# EAGLE design slave (EAGLE 6.5.0)
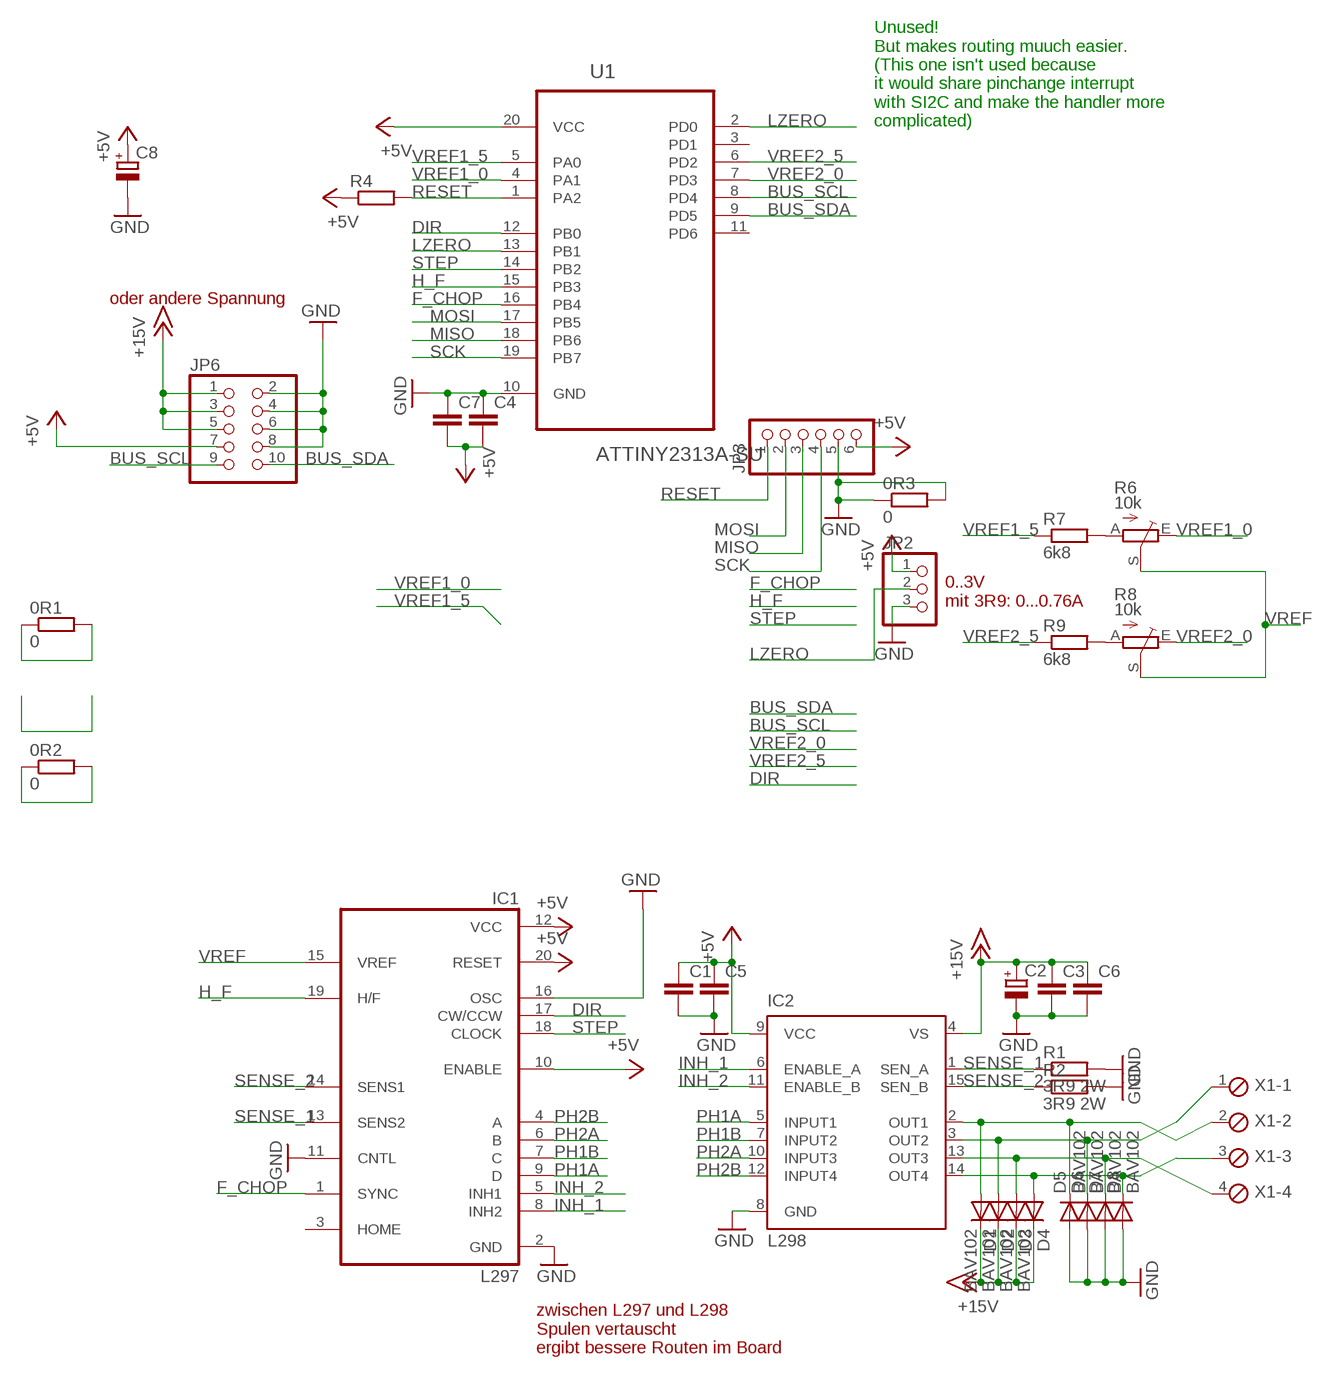
[diagram p0: schematic, sheet 1]

## Parts
0R1  0  R-EU_R1206  [R1206]
0R2  0  R-EU_R1206  [R1206]
0R3  0  R-EU_R1206  [R1206]
C1  C-EUC0805  [C0805]
C2  CPOL-EUE2.5-7  [E2,5-7]
C3  C-EUC0805  [C0805]
C4  C-EUC0805  [C0805]
C5  C-EUC0805  [C0805]
C6  C-EUC0805  [C0805]
C7  C-EUC0805  [C0805]
C8  CPOL-EUE2.5-7  [E2,5-7]
D1  BAV102  DIODE-MINIMELF  [MINIMELF]
D2  BAV102  DIODE-MINIMELF  [MINIMELF]
D3  BAV102  DIODE-MINIMELF  [MINIMELF]
D4  BAV102  DIODE-MINIMELF  [MINIMELF]
D5  BAV102  DIODE-MINIMELF  [MINIMELF]
D6  BAV102  DIODE-MINIMELF  [MINIMELF]
D7  BAV102  DIODE-MINIMELF  [MINIMELF]
D8  BAV102  DIODE-MINIMELF  [MINIMELF]
IC1  L297  [DIL20]
IC2  L298  [MULTIWATT-15]
JP2  PINHD-1X3  [1X03]
JP3  PINHD-1X6  [1X06]
JP6  PINHD-2X5  [2X05]
R1  3R9 2W  R-EU_0414/15  [0414/15]
R2  3R9 2W  R-EU_0414/15  [0414/15]
R4  R-EU_R1206  [R1206]
R6  10k  TRIM_EU-PT10  [PT-10]
R7  6k8  R-EU_R1206  [R1206]
R8  10k  TRIM_EU-PT10  [PT-10]
R9  6k8  R-EU_R1206  [R1206]
U1  ATTINY2313A-SU  [SOIC127P1032X265-20N]
X1  MPT4  [4POL254]

## Nets
+5V: 0R1.1 0R1.2 C1.1 C4.2 C5.1 C7.2 C8.+ IC1.10(ENABLE) IC1.12(VCC) IC1.20(RESET) IC2.9(VCC) JP2.1 JP3.6 JP6.7 R4.1 U1.20(VCC)
+15V: C2.+ C3.1 C6.1 D1.C D2.C D3.C D4.C IC2.4(VS) JP6.1 JP6.3 JP6.5
BUS_SCL: JP6.9 U1.8(PD4)
BUS_SDA: JP6.10 U1.9(PD5)
DIR: IC1.17(CW/CCW) U1.12(PB0)
F_CHOP: IC1.1(SYNC) U1.16(PB4)
GND: 0R3.1 0R3.2 C1.2 C2.- C3.2 C4.1 C5.2 C6.2 C7.1 C8.- D5.A D6.A D7.A D8.A IC1.2(GND) IC1.11(CNTL) IC1.16(OSC) IC2.8(GND) JP2.3 JP3.5 JP6.2 JP6.4 JP6.6 JP6.8 R1.2 R2.2 U1.10(GND)
H_F: IC1.19(H/F) U1.15(PB3)
INH_1: IC1.8(INH2) IC2.6(ENABLE_A)
INH_2: IC1.5(INH1) IC2.11(ENABLE_B)
LZERO: JP2.2 U1.2(PD0) U1.13(PB1)
MISO: JP3.3 U1.18(PB6)
MOSI: JP3.2 U1.17(PB5)
N$1: R6.A R7.2
N$3: R8.A R9.2
N$12: D1.A D5.C IC2.2(OUT1) X1.2
N$13: D2.A D6.C IC2.3(OUT2) X1.1
N$14: D3.A D7.C IC2.13(OUT3) X1.4
N$15: D4.A D8.C IC2.14(OUT4) X1.3
PH1A: IC1.9(D) IC2.5(INPUT1)
PH1B: IC1.7(C) IC2.7(INPUT2)
PH2A: IC1.6(B) IC2.10(INPUT3)
PH2B: IC1.4(A) IC2.12(INPUT4)
RESET: JP3.1 R4.2 U1.1(PA2)
SCK: JP3.4 U1.19(PB7)
SENSE_1: IC1.13(SENS2) IC2.1(SEN_A) R1.1
SENSE_2: IC1.14(SENS1) IC2.15(SEN_B) R2.1
STEP: IC1.18(CLOCK) U1.14(PB2)
VREF: 0R2.1 0R2.2 IC1.15(VREF) R6.S R8.S
VREF1_0: R6.E U1.4(PA1)
VREF1_5: R7.1 U1.5(PA0)
VREF2_0: R8.E U1.7(PD3)
VREF2_5: R9.1 U1.6(PD2)
Unconnected: IC1.3(HOME) U1.3(PD1) U1.11(PD6)

## Notes on the sheet
- Unused!
  But makes routing muuch easier.
  (This one isn't used because
  it would share pinchange interrupt
  with SI2C and make the handler more
  complicated)
- oder andere Spannung
- 0..3V
  mit 3R9: 0...0.76A
- zwischen L297 und L298
  Spulen vertauscht
  ergibt bessere Routen im Board

## Library data of the parts
0R1-0R3 R1 R2 R4 R7 R9 = rcl:R-EU_: RESISTOR, European symbol
C1 C3-C7 = rcl:C-EU: CAPACITOR, European symbol
C2 C8 = rcl:CPOL-EU: POLARIZED CAPACITOR, European symbol
D1-D8 = diode:DIODE-: DIODE
IC1 = st-microelectronics:L297: STEPPER MOTOR CONTROLLER; MPN: L297/1; OC_FARNELL: 1094209; OC_NEWARK: 56P8258
IC2 = l298pad:L298: DUAL FULL-BRIDGE DRIVER; MPN: L298N; OC_FARNELL: 1589425; OC_NEWARK: 32M1527
JP2 = pinhead:PINHD-1X3: PIN HEADER
JP3 = pinhead:PINHD-1X6: PIN HEADER
JP6 = pinhead:PINHD-2X5: PIN HEADER
R6 R8 = pot:TRIM_EU-: POTENTIOMETER
U1 = Atmel_By_element14_Batch_1-00:ATTINY2313A-SU: 8-bit Microcontroller with In-System Programmable Flash; MPN: ATTINY2313A-SU; OC_FARNELL: 1841617; OC_NEWARK: 12T1334; PACKAGE: SOIC-20; SUPPLIER: Atmel
X1 = con-phoenix-254:MPT4: PHOENIX CONNECTOR; OC_FARNELL: unknown; OC_NEWARK: unknown

## Board
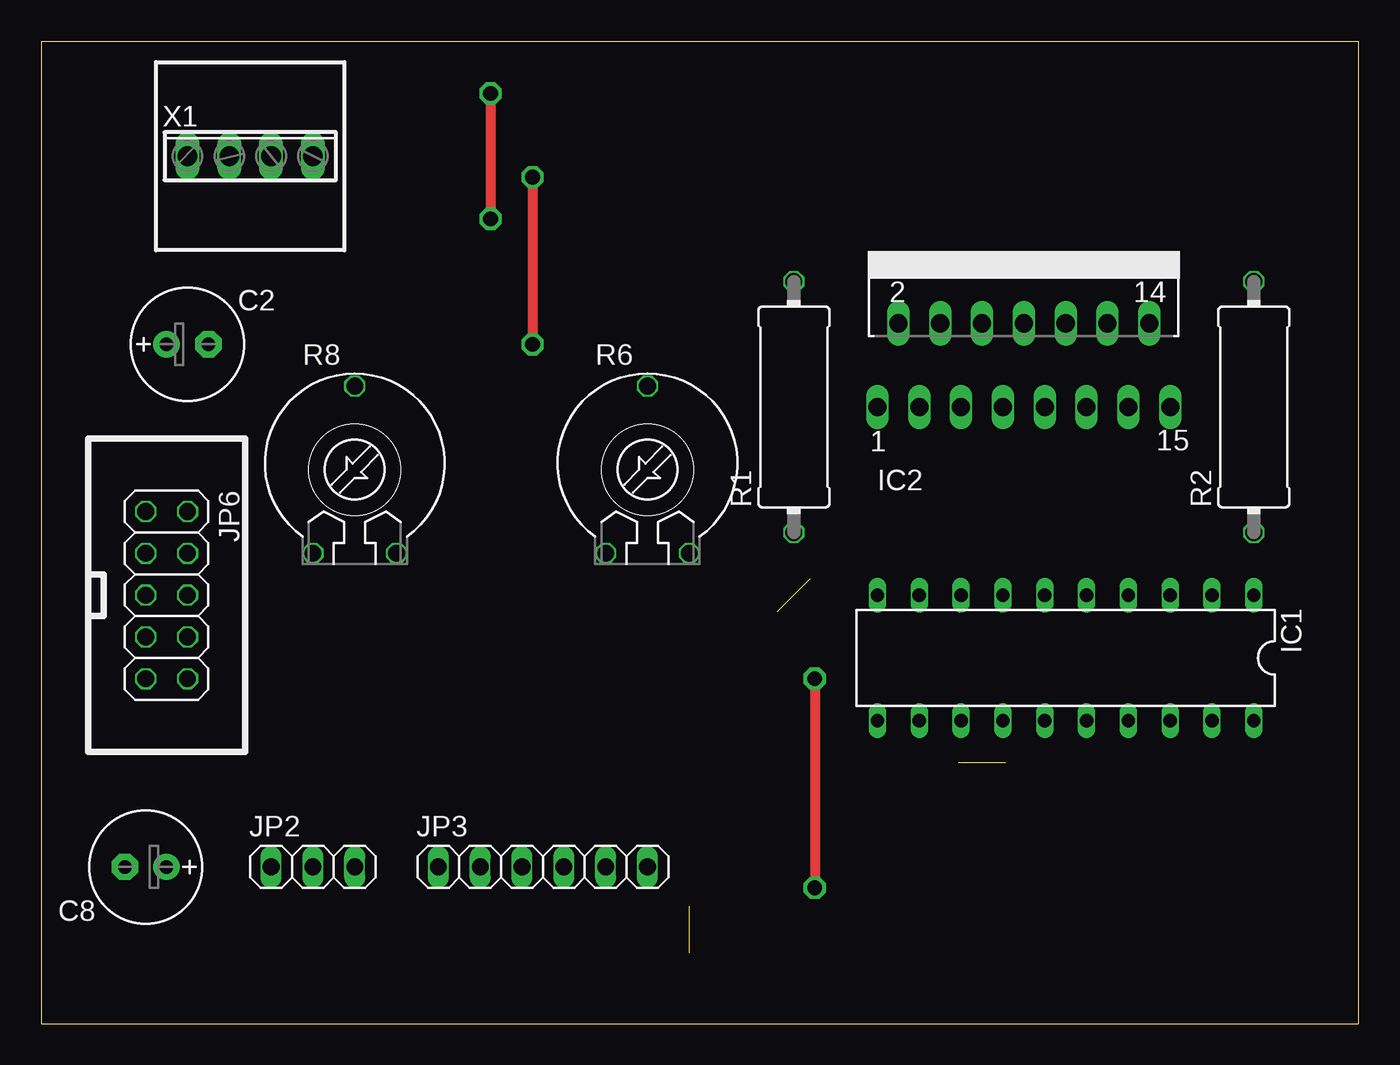
[diagram p1: board, top side]
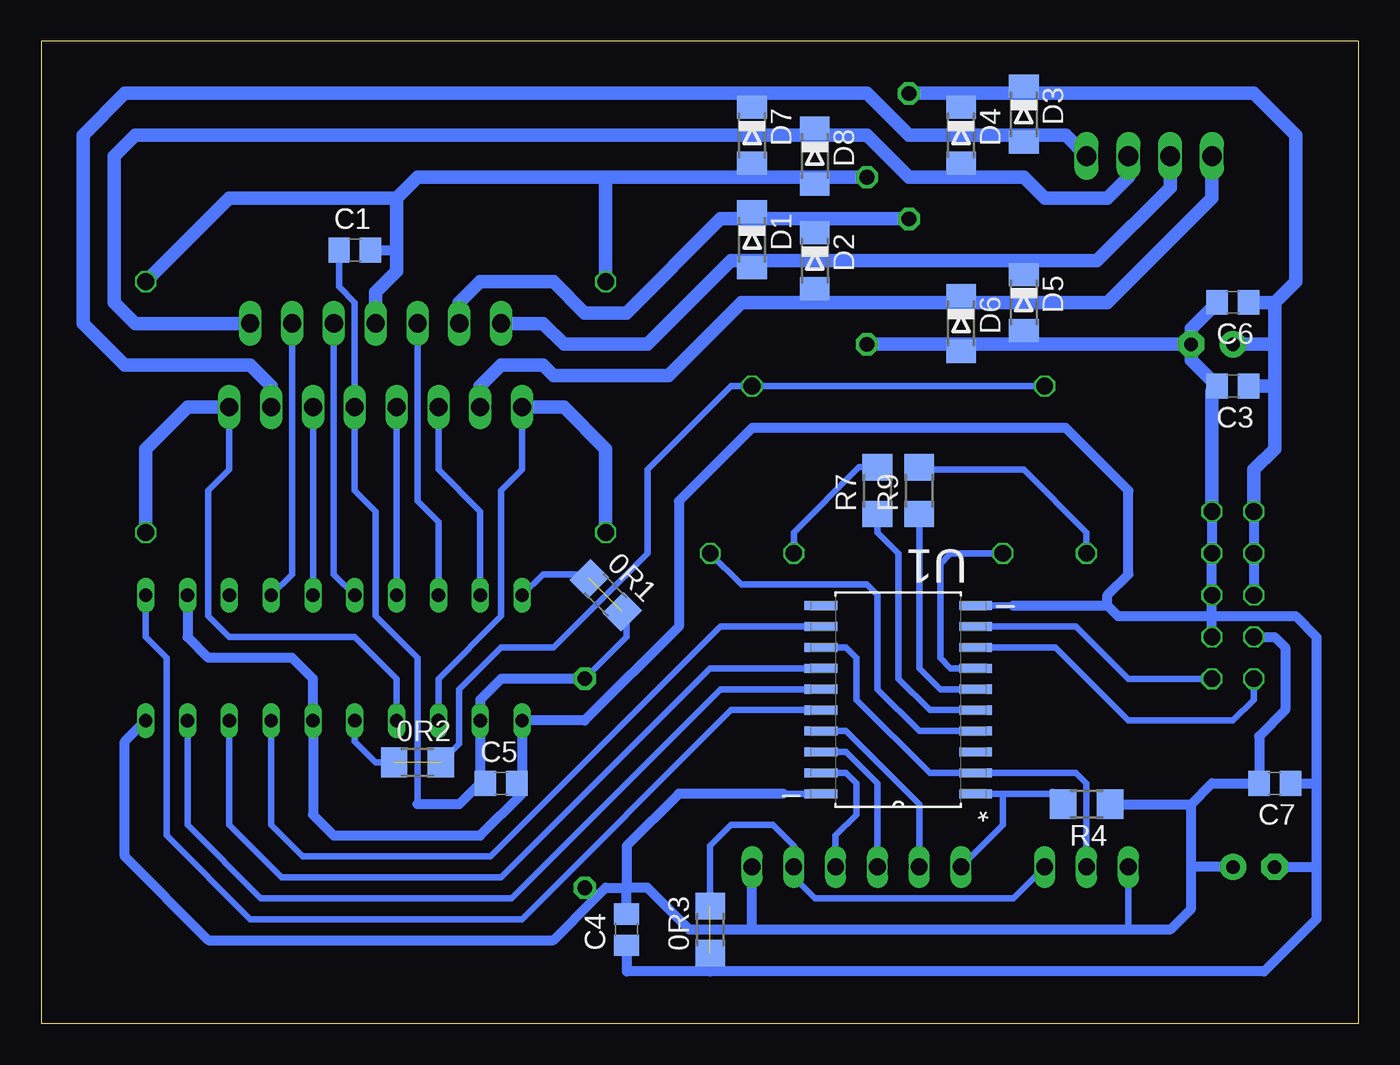
[diagram p2: board, bottom side, seen from below]

Size 80.01 x 59.69 mm. Coordinates in mm from the lower left corner, seen from the top.
Outline: 0,59.69 0,0 80.01,0 80.01,59.69 0,59.69
Copper layers (1*16): Top 0.035mm / dielectric 1.5mm / Bottom 0.035mm
Design rules "default *": minimum track width 10mil, minimum drill 24mil, track to track 16mil, track to pad 16mil, pad to pad 20mil, via to via 20mil, smd to smd 8mil, copper to edge 40mil, drill to drill 8mil, minimum pad ring 5mil, minimum via ring 8mil, stop-mask expansion 4mil, vias tented up to drill 0mil, thermal gap 16mil

### Footprints (pad centres in the part's own frame; a part is rotated, then mirrored left to right if it is on the bottom)
R1206 = smd 1.6 x 1.803: 1 -1.422,0; 2 1.422,0
C0805 = smd 1.3 x 1.5: 1 -0.95,0; 2 0.95,0
E2,5-7 = drill 0.813 pad 1.6: + -1.27,0 | drill 0.813 pad 1.6 octagon: - 1.27,0
MINIMELF = smd 1.4 x 1.8: A 1.7,0; C -1.7,0
DIL20 = drill 0.813 long: 1 -11.43,-3.81; 2 -8.89,-3.81; 3 -6.35,-3.81; 4 -3.81,-3.81; 5 -1.27,-3.81; 6 1.27,-3.81; 7 3.81,-3.81; 8 6.35,-3.81; 9 8.89,-3.81; 10 11.43,-3.81; 11 11.43,3.81; 12 8.89,3.81; 13 6.35,3.81; 14 3.81,3.81; 15 1.27,3.81; 16 -1.27,3.81; 17 -3.81,3.81; 18 -6.35,3.81; 19 -8.89,3.81; 20 -11.43,3.81
MULTIWATT-15 = drill 1.1 pad 1.27 long: 1 -8.89,-7.62; 2 -7.62,-2.54; 3 -6.35,-7.62; 4 -5.08,-2.54; 5 -3.81,-7.62; 6 -2.54,-2.54; 7 -1.27,-7.62; 8 0,-2.54; 9 1.27,-7.62; 10 2.54,-2.54; 11 3.81,-7.62; 12 5.08,-2.54; 13 6.35,-7.62; 14 7.62,-2.54; 15 8.89,-7.62
1X03 = drill 1.016 long: 1 -2.54,0; 2 0,0; 3 2.54,0
1X06 = drill 1.016 long: 1 -6.35,0; 2 -3.81,0; 3 -1.27,0; 4 1.27,0; 5 3.81,0; 6 6.35,0
2X05 = drill 1.016 octagon: 1 -5.08,-1.27; 2 -5.08,1.27; 3 -2.54,-1.27; 4 -2.54,1.27; 5 0,-1.27; 6 0,1.27; 7 2.54,-1.27; 8 2.54,1.27; 9 5.08,-1.27; 10 5.08,1.27
0414/15 = drill 1.016 octagon: 1 -7.62,0; 2 7.62,0
PT-10 = drill 1.016 octagon: A -2.54,-5.08; E 2.54,-5.08; S 0,5.08
SOIC127P1032X265-20N = smd 1.981 x 0.559: 1 -4.699,5.715; 2 -4.699,4.445; 3 -4.699,3.175; 4 -4.699,1.905; 5 -4.699,0.635; 6 -4.699,-0.635; 7 -4.699,-1.905; 8 -4.699,-3.175; 9 -4.699,-4.445; 10 -4.699,-5.715; 11 4.699,-5.715; 12 4.699,-4.445; 13 4.699,-3.175; 14 4.699,-1.905; 15 4.699,-0.635; 16 4.699,0.635; 17 4.699,1.905; 18 4.699,3.175; 19 4.699,4.445; 20 4.699,5.715
4POL254 = drill 1.2 long: 1 -3.81,0; 2 -1.27,0; 3 1.27,0; 4 3.81,0

### Placement (x,y rotation side)
0R1  45.72,26.03 315 bottom
0R2  57.15,15.88 0 bottom
0R3  39.37,5.71 90 bottom
C1  60.96,46.99 0 bottom
C2  8.89,41.27 0 top
C3  7.62,38.73 180 bottom
C4  44.45,5.71 90 bottom
C5  52.07,14.61 0 bottom
C6  7.62,43.81 180 bottom
C7  5.08,14.61 180 bottom
C8  6.35,9.52 180 top
D1  36.83,47.62 270 bottom
D2  33.02,46.35 270 bottom
D3  20.32,55.24 270 bottom
D4  24.13,53.98 270 bottom
D5  20.32,43.81 270 bottom
D6  24.13,42.55 270 bottom
D7  36.83,53.98 270 bottom
D8  33.02,52.71 270 bottom
IC1  62.23,22.23 180 top
IC2  59.69,45.09 0 top
JP2  16.51,9.52 0 top
JP3  30.48,9.52 0 top
JP6  7.62,26.03 270 top
R1  45.72,37.46 90 top
R2  73.66,37.46 90 top
R4  16.51,13.34 180 bottom
R6  36.83,33.66 0 top
R7  29.21,32.38 90 bottom
R8  19.05,33.66 0 top
R9  26.67,32.38 90 bottom
U1  27.94,19.69 180 bottom
X1  12.7,52.71 0 top

### Tracks (layer width: path | path; a pad name or v marks a point on that pad's centre or on a via)
+5V  (via drill 0.9)  (1 unrouted)
  Top 0.61: v46.99,20.95 v46.99,8.25
  Bottom 0.406: 57.15,13.34 57.15,22.23 59.69,24.77 59.69,31.12 60.96,32.38 IC2.9 60.96,43.81 61.91,44.77 C1.1 | U1.20 34.92,13.97 | JP2.1 13.97,5.71 | IC1.10 49.53,27.3 46.99,27.3 0R1.1 | v46.99,20.95 44.45,23.49 44.45,24.77 0R1.2 | C5.1 53.34,14.61
  Bottom 0.61: JP6.7 5.08,23.49 4.45,22.86 4.45,19.05 6.03,17.46 C7.2 8.89,14.61 10.16,13.34 | 36.83,5.71 13.97,5.71 11.43,5.71 10.16,6.98 10.16,9.52 | 36.83,5.71 40.64,5.71 43.18,8.25 44.45,8.25 | 57.15,13.34 54.61,13.34 53.34,14.61 IC1.12 53.34,19.69 52.07,20.95 v46.99,20.95 | 44.45,8.25 44.45,10.79 41.27,13.97 34.92,13.97 | IC1.20 74.93,17.14 74.93,10.16 69.85,5.08 48.89,5.08 46.35,7.62 | C4.2 44.45,8.25 | 36.83,5.71 JP3.6 | 46.35,7.62 45.72,8.25 44.45,8.25 | v46.99,8.25 46.35,7.62 | 10.16,9.52 10.16,13.34 | R4.1 10.16,13.34 | C8.+ 10.16,9.52
+15V  (via drill 0.9)
  Top 0.61: v27.3,56.51 v27.3,48.89
  Bottom 0.406: D3.C 20.32,56.51 | D4.C 24.13,56.51 | D1.C 36.83,48.89 | D2.C 33.02,48.89
  Bottom 0.61: JP6.5 JP6.3 JP6.1
  Bottom 0.813: JP6.1 6.35,33.66 5.08,34.92 5.08,38.73 | IC2.4 54.61,43.81 53.34,45.09 48.89,45.09 46.99,43.18 44.45,43.18 38.73,48.89 36.83,48.89 33.02,48.89 v27.3,48.89 | 5.08,43.81 3.81,45.09 3.81,53.98 6.35,56.51 20.32,56.51 24.13,56.51 v27.3,56.51 | 5.08,43.81 5.08,41.27 | 5.08,41.27 5.08,38.73 | C2.+ 5.08,41.27 | C6.1 5.08,43.81 | C3.1 5.08,38.73
BUS_SCL
  Bottom 0.406: JP6.9 6.35,19.69 7.62,18.41 13.97,18.41 18.41,22.86 U1.8
BUS_SDA
  Bottom 0.406: JP6.10 13.97,20.95 17.15,24.13 U1.9
DIR
  Bottom 0.406: IC1.17 66.04,12.06 64.14,10.16 52.7,10.16 38.73,24.13 U1.12
F_CHOP
  Bottom 0.406: IC1.1 73.66,23.49 72.39,22.23 72.39,11.43 67.31,6.35 50.8,6.35 38.1,19.05 U1.16
GND  (via drill 0.9)  (1 unrouted)
  Top 0.61: v29.84,51.43 v29.84,41.27
  Bottom 0.406: U1.10 20.95,25.4 | 0R3.2 39.37,10.79 38.1,12.06 35.56,12.06 34.29,10.79 JP3.5 34.29,8.89 33.02,7.62 20.95,7.62 JP2.3 | D8.A 33.02,51.43 | D7.A 36.83,51.43 | D5.A 20.32,41.27 | D6.A 24.13,41.27 | C5.2 50.8,14.61
  Bottom 0.61: JP6.8 8.89,24.77 | 8.89,24.77 JP6.6 JP6.4 JP6.2 | IC1.2 71.12,23.49 69.85,22.23 64.77,22.23 63.5,20.95 IC1.16 63.5,12.7 62.23,11.43 53.34,11.43 50.8,13.97 50.8,14.61 IC1.11 46.99,18.41 41.27,24.13 41.27,31.75 36.83,36.2 17.78,36.2 13.97,32.38 13.97,27.3 15.24,26.03 15.24,25.4 | 39.37,3.18 5.71,3.18 2.54,6.35 2.54,9.52 | 39.37,3.18 44.45,3.18 C4.1 | C1.2 58.42,46.99 | 8.89,24.77 14.6,24.77 15.24,25.4 | 8.89,24.77 3.81,24.77 2.54,23.49 2.54,14.61 | 2.54,14.61 2.54,9.52 | 20.95,25.4 15.24,25.4 | C7.1 2.54,14.61 | 0R3.1 39.37,3.18 | C8.- 2.54,9.52
  Bottom 0.813: IC2.8 59.69,44.45 58.42,45.72 58.42,46.99 58.42,50.16 | C6.2 10.16,42.23 C2.- | C2.- 10.16,40.32 C3.2 8.89,38.41 JP6.2 | 45.72,51.43 R1.2 | R2.2 68.58,50.16 58.42,50.16 | 58.42,50.16 57.15,51.43 45.72,51.43 | 45.72,51.43 36.83,51.43 33.02,51.43 v29.84,51.43 | v29.84,41.27 24.13,41.27 20.32,41.27 C2.-
H_F
  Bottom 0.406: IC1.19 71.12,12.06 66.68,7.62 51.43,7.62 38.73,20.32 U1.15
INH_1
  Bottom 0.406: IC2.6 57.15,31.75 55.88,30.48 IC1.8
INH_2
  Bottom 0.406: IC1.5 IC2.11
LZERO
  Bottom 0.406: JP2.2 16.51,14.61 17.15,15.24 U1.2 26.03,15.24 30.48,19.69 30.48,22.23 31.12,22.86 U1.13
MISO
  Bottom 0.406: U1.18 31.12,16.51 29.21,14.61 JP3.3
MOSI
  Bottom 0.406: U1.17 31.12,17.78 26.67,13.34 JP3.2
N$1
  Bottom 0.406: R6.A 34.29,29.84 30.33,33.81 R7.2
N$3
  Bottom 0.406: 26.52,33.66 20.32,33.66 16.51,29.84 R8.A
  Bottom 0.61: 26.52,33.66 R9.2
N$12
  Bottom 0.406: D1.A 36.83,46.35 | D5.C 20.32,46.35
  Bottom 0.813: X1.2 11.43,50.8 15.88,46.35 20.32,46.35 36.83,46.35 38.1,46.35 43.18,41.27 48.26,41.27 49.53,42.55 IC2.2
N$13
  Bottom 0.406: D2.A 33.02,43.81 | D6.C 24.13,43.81
  Bottom 0.813: IC2.3 53.34,38.73 52.07,40.01 49.53,40.01 48.89,39.37 41.91,39.37 37.46,43.81 33.02,43.81 24.13,43.81 15.24,43.81 8.89,50.16 X1.1
N$14
  Bottom 0.406: D3.A 20.32,53.98 | D7.C 36.83,56.51
  Bottom 0.813: IC2.13 66.04,38.73 67.31,40.01 74.93,40.01 77.47,42.55 77.47,53.98 74.93,56.51 36.83,56.51 29.84,56.51 27.3,53.98 20.32,53.98 17.78,53.98 X1.4
N$15
  Bottom 0.406: D4.A 24.13,51.43 | D8.C 33.02,53.98
  Bottom 0.813: IC2.14 74.3,42.55 75.57,43.81 75.57,52.71 74.3,53.98 33.02,53.98 29.84,53.98 27.3,51.43 24.13,51.43 20.32,51.43 19.05,50.16 15.24,50.16 13.97,51.43 X1.3
PH1A
  Bottom 0.406: IC1.9 53.34,31.12 55.88,33.66 IC2.5
PH1B
  Bottom 0.406: IC1.7 IC2.7
PH2A
  Bottom 0.406: IC2.10 62.23,27.3 IC1.6
PH2B
  Bottom 0.406: IC1.4 64.77,27.3 IC2.12
RESET
  Bottom 0.406: JP3.1 21.59,12.06 21.59,13.97 | U1.1 21.59,13.97 | 21.59,13.97 18.57,13.97
  Bottom 0.61: 18.57,13.97 R4.2
SCK
  Bottom 0.406: U1.19 31.12,15.24 30.48,14.61 30.48,12.7 31.75,11.43 JP3.4
SENSE_1
  Bottom 0.406: IC2.1 50.8,33.66 52.07,32.38 52.07,24.77 55.88,20.95 IC1.13
  Bottom 0.813: IC2.1 48.26,37.46 45.72,34.92 R1.1
SENSE_2
  Bottom 0.406: IC1.14 58.42,20.95 60.96,23.49 68.58,23.49 69.85,24.77 69.85,32.38 68.58,33.66 IC2.15
  Bottom 0.813: IC2.15 71.12,37.46 73.66,34.92 R2.1
STEP
  Bottom 0.406: IC1.18 68.58,12.06 65.41,8.89 52.07,8.89 39.37,21.59 U1.14
VREF  (1 unrouted)
  Bottom 0.406: R8.S R6.S 38.1,38.73 43.18,33.66 43.18,28.57 48.89,22.86 52.07,22.86 54.61,20.32 54.61,16.99 0R2.2 | IC1.15 60.96,17.14 59.69,15.88 0R2.1
VREF1_0
  Bottom 0.406: U1.4 26.67,17.78 29.21,20.32 29.21,26.03 29.84,26.67 37.46,26.67 R6.E
VREF1_5
  Bottom 0.406: U1.5 26.03,19.05 27.94,20.95 27.94,28.57 29.21,29.84 R7.1
VREF2_0
  Bottom 0.406: R8.E 24.77,28.57 25.4,27.94 25.4,22.23 24.77,21.59 U1.7
VREF2_5
  Bottom 0.406: U1.6 25.4,20.32 26.67,21.59 R9.1

### Text on the board
Document: 3.15 x 2.30 [in] / 8.001 x 5.842 [cm]